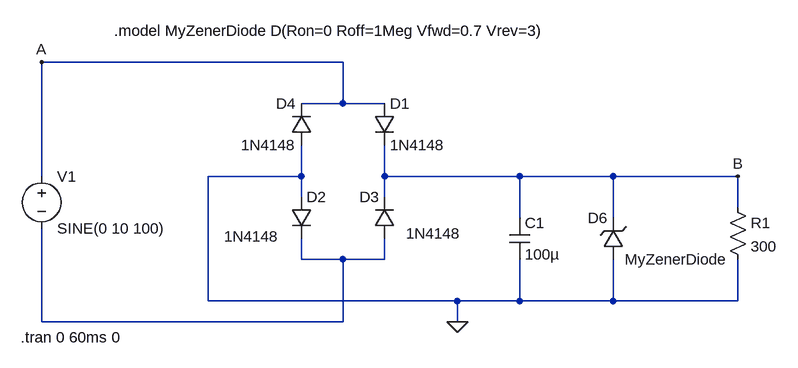
[diagram p0: schematic Project 1.asc]
Project 1.asc, the LTspice schematic file:
Version 4
SHEET 1 964 680
WIRE 288 -256 -176 -256
WIRE 288 -192 288 -256
WIRE 288 -192 224 -192
WIRE 352 -192 288 -192
WIRE -176 -80 -176 -256
WIRE 224 -80 224 -128
WIRE 224 -80 80 -80
WIRE 352 -80 352 -128
WIRE 560 -80 352 -80
WIRE 704 -80 560 -80
WIRE 896 -80 704 -80
WIRE 224 -48 224 -80
WIRE 352 -48 352 -80
WIRE 896 -32 896 -80
WIRE 560 -16 560 -80
WIRE 704 -16 704 -80
WIRE 224 48 224 16
WIRE 288 48 224 48
WIRE 352 48 352 16
WIRE 352 48 288 48
WIRE 80 112 80 -80
WIRE 464 112 80 112
WIRE 560 112 560 48
WIRE 560 112 464 112
WIRE 704 112 704 48
WIRE 704 112 560 112
WIRE 896 112 896 48
WIRE 896 112 704 112
WIRE -176 144 -176 0
WIRE 288 144 288 48
WIRE 288 144 -176 144
WIRE 464 144 464 112
FLAG 464 144 0
FLAG -176 -256 A
FLAG 896 -80 B
SYMBOL diode 336 -192 R0
SYMATTR InstName D1
SYMATTR Value 1N4148
SYMBOL diode 208 -48 R0
WINDOW 3 -103 61 Left 2
SYMATTR Value 1N4148
SYMATTR InstName D2
SYMBOL diode 240 -128 R180
WINDOW 0 24 64 Left 2
WINDOW 3 24 0 Left 2
SYMATTR InstName D4
SYMATTR Value 1N4148
SYMBOL diode 368 16 R180
WINDOW 0 24 64 Left 2
WINDOW 3 -102 8 Left 2
SYMATTR InstName D3
SYMATTR Value 1N4148
SYMBOL voltage -176 -96 R0
WINDOW 123 0 0 Left 0
WINDOW 39 0 0 Left 0
SYMATTR InstName V1
SYMATTR Value SINE(0 10 100)
SYMBOL cap 544 -16 R0
SYMATTR InstName C1
SYMATTR Value 100µ
SYMBOL zener 720 48 R180
WINDOW 0 24 64 Left 2
WINDOW 3 -161 0 Left 2
SYMATTR InstName D6
SYMATTR Value MyZenerDiode
SYMBOL res 880 -48 R0
SYMATTR InstName R1
SYMATTR Value 300
TEXT -208 168 Left 2 !.tran 0 60ms 0
TEXT -64 -304 Left 2 !.model MyZenerDiode D(Ron=0 Roff=1Meg Vfwd=0.7 Vrev=3)

The netlist it stands for:
* Project 1.asc
D1 A B 1N4148
D2 0 N001 1N4148
D4 0 A 1N4148
D3 N001 B 1N4148
V1 A N001 SINE(0 10 100)
C1 B 0 100µ
D6 0 B MyZenerDiode
R1 B 0 300
.model D D
.lib standard.dio
.tran 0 60ms 0
.model MyZenerDiode D(Ron=0 Roff=1Meg Vfwd=0.7 Vrev=3)
.backanno
.end